# Altium schematic sheet 11-Sensors.SchDoc
size A4
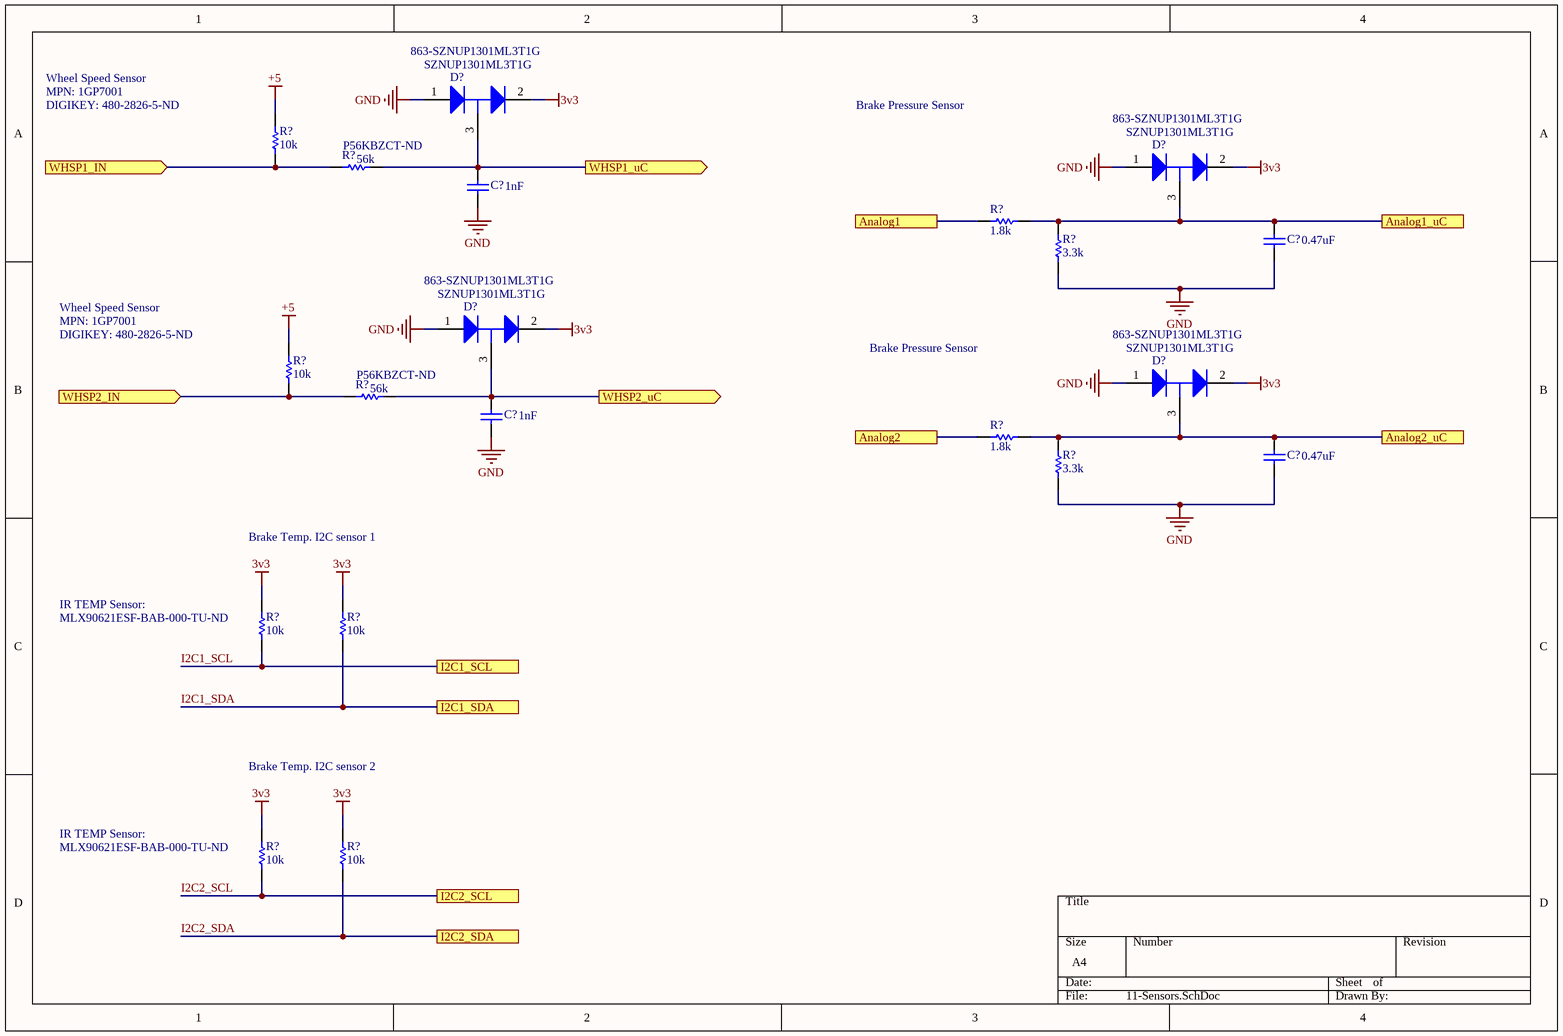
[diagram p0: 11-Sensors.SchDoc]

## Parts
(Parts that share a designator on the sheet are numbered #1, #2 ... from top to bottom, then left to right.)
C?#1  1nF  [CAPC0603(1608)100_N]
C?#2  0.47uF  [CAPC0603(1608)100_N]
C?#3  1nF  [CAPC0603(1608)100_N]
C?#4  0.47uF  [CAPC0603(1608)100_N]
D?#1  SZNUP1301ML3T1G  Supplier Part Number 1: 863-SZNUP1301ML3T1G  [ONSC-SOT-23-3-318-08_V]
D?#2  SZNUP1301ML3T1G  Supplier Part Number 1: 863-SZNUP1301ML3T1G  [ONSC-SOT-23-3-318-08_V]
D?#3  SZNUP1301ML3T1G  Supplier Part Number 1: 863-SZNUP1301ML3T1G  [ONSC-SOT-23-3-318-08_V]
D?#4  SZNUP1301ML3T1G  Supplier Part Number 1: 863-SZNUP1301ML3T1G  [ONSC-SOT-23-3-318-08_V]
R?#1  10k  [RESC0603(1608)_N]
R?#2  56k  [RESC0603(1608)_N]
R?#3  1.8k  [RESC0603(1608)_N]
R?#4  3.3k  [RESC0603(1608)_N]
R?#5  10k  [RESC0603(1608)_N]
R?#6  56k  [RESC0603(1608)_N]
R?#7  1.8k  [RESC0603(1608)_N]
R?#8  3.3k  [RESC0603(1608)_N]
R?#9  10k  [RESC0603(1608)_N]
R?#10  10k  [RESC0603(1608)_N]
R?#11  10k  [RESC0603(1608)_N]
R?#12  10k  [RESC0603(1608)_N]

## Ports
Analog1, Analog1_uC, Analog2, Analog2_uC, I2C1_SCL, I2C1_SDA, I2C2_SCL, I2C2_SDA, WHSP1_IN (in), WHSP1_uC (out), WHSP2_IN (in), WHSP2_uC (out)

## Nets
3v3: D?#1.2(K) D?#2.2(K) D?#3.2(K) D?#4.2(K) R?#9.2 R?#10.2 R?#11.2 R?#12.2
+5: R?#1.2 R?#5.2
GND: C?#1.1 C?#2.1 C?#3.1 C?#4.1 D?#1.1(A) D?#2.1(A) D?#3.1(A) D?#4.1(A) R?#4.1 R?#8.1
Analog1: R?#3.2 ; port Analog1
Analog1_uC: C?#2.2 D?#2.3(K/A) R?#3.1 R?#4.2 ; port Analog1_uC
Analog2: R?#7.2 ; port Analog2
Analog2_uC: C?#4.2 D?#4.3(K/A) R?#7.1 R?#8.2 ; port Analog2_uC
I2C1_SCL: R?#9.1 ; port I2C1_SCL
I2C1_SDA: R?#10.1 ; port I2C1_SDA
I2C2_SCL: R?#11.1 ; port I2C2_SCL
I2C2_SDA: R?#12.1 ; port I2C2_SDA
WHSP1_IN: R?#1.1 R?#2.1 ; port WHSP1_IN
WHSP1_uC: C?#1.2 D?#1.3(K/A) R?#2.2 ; port WHSP1_uC
WHSP2_IN: R?#5.1 R?#6.1 ; port WHSP2_IN
WHSP2_uC: C?#3.2 D?#3.3(K/A) R?#6.2 ; port WHSP2_uC

## Notes on the sheet
- Wheel Speed Sensor
- MPN: 1GP7001
- DIGIKEY: 480-2826-5-ND
- Brake Pressure Sensor
- (near R?#2) P56KBZCT-ND
- (near R?#6) P56KBZCT-ND
- Brake Temp. I2C sensor 1
- IR TEMP Sensor:
- (near R?#9) MLX90621ESF-BAB-000-TU-ND
- Brake Temp. I2C sensor 2
- (near R?#11) MLX90621ESF-BAB-000-TU-ND

## Library data of the parts
C?#1-C?#4 = CMP-1035-02589-1: CAP 100nF 25V ±20% 0603 (1608 Metric) Thickness 1mm SMD; Case-EIA: 0603; Tolerance: Â±20%; Case-Metric: 1608; Value: 100nF; Max Thickness: 1 mm; Technology: SMT; Rated Voltage: 25 V
D?#1-D?#4 = CMP-1063-00171-1: Low Capacitance Diode Array for ESD Protection in a Single Data Line, 3-Pin SOT-23, Pb-Free, Tape and Reel; Manufacturer: On Semiconductor; C Max (pF): 0.9; Direction: Bidirectional; V(BR) Min (V): 70; Number of Lines: 1; Mounting Technology: Surface Mount; PackageReference: SOT-23-3-318-08; DatasheetVersion: Rev. 6; PackageVersion: Rev. AP, 11/2009; RoHS: Pb-Free; ComponentLink1Description: Manufacturer URL; ComponentLink1URL: http://www.onsemi.com/; PackageDescription: 3-Pin Small Outline Transistor, Body 2.92 x 1.3 mm, Pitch 0.95 mm; PartNumber: SZNUP1301ML3T1G; Packing: Tape and Reel; ComponentLink3URL: http://www.onsemi.cn/pub_link/Collateral/318-08.PDF; ComponentLink3Description: Package Specification; VRWM Max (V): 70; ComponentLink2Description: Datasheet; ComponentLink2URL: http://www.onsemi.cn/pub_link/Collateral/NUP1301ML3T1-D.PDF; Supplier 1: Mouser
R?#1-R?#12 = CMP-1012-00048-1: 82R 0.1W 5% 0603 (1608 Metric)  SMD; Case-Metric: 1608; Value: 82.00 Ohm; Case-EIA: 0603; Technology: SMT; Tolerance: 5 %; Power: 0.1 W